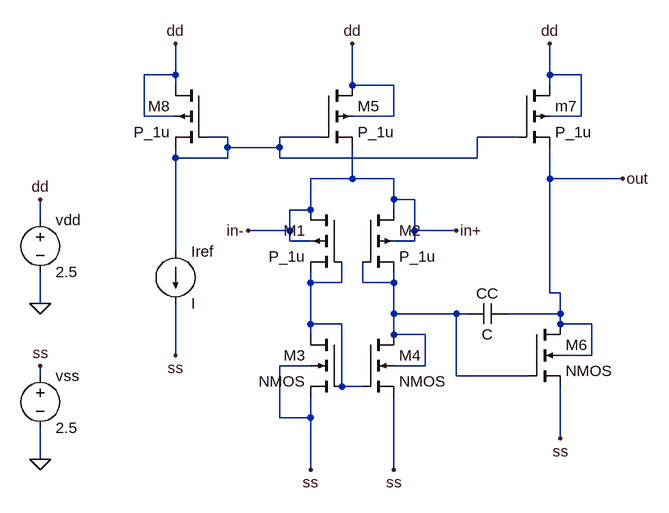
[diagram p0: schematic Draft1.asc]
Draft1.asc, the LTspice schematic file:
Version 4
SHEET 1 880 680
WIRE -272 -272 -272 -320
WIRE -272 -272 -320 -272
WIRE 304 -272 304 -320
WIRE 352 -272 304 -272
WIRE -272 -256 -272 -272
WIRE 0 -256 0 -320
WIRE 64 -256 0 -256
WIRE 304 -256 304 -272
WIRE -320 -208 -320 -272
WIRE -272 -208 -320 -208
WIRE 64 -208 64 -256
WIRE 64 -208 0 -208
WIRE 352 -208 352 -272
WIRE 352 -208 304 -208
WIRE -192 -176 -224 -176
WIRE -48 -176 -112 -176
WIRE 256 -176 192 -176
WIRE -192 -160 -192 -176
WIRE -112 -160 -112 -176
WIRE -112 -160 -192 -160
WIRE -272 -144 -272 -160
WIRE -192 -144 -192 -160
WIRE -192 -144 -272 -144
WIRE -112 -144 -112 -160
WIRE 192 -144 192 -176
WIRE 192 -144 -112 -144
WIRE 0 -112 0 -160
WIRE 0 -112 -64 -112
WIRE 64 -112 0 -112
WIRE 304 -112 304 -160
WIRE 416 -112 304 -112
WIRE 64 -80 64 -112
WIRE 96 -80 64 -80
WIRE -64 -64 -64 -112
WIRE -64 -64 -96 -64
WIRE 64 -64 64 -80
WIRE -480 -48 -480 -80
WIRE -96 -32 -96 -64
WIRE -96 -32 -160 -32
WIRE 96 -32 96 -80
WIRE 160 -32 96 -32
WIRE -96 -16 -96 -32
WIRE -64 -16 -96 -16
WIRE 96 -16 96 -32
WIRE 96 -16 64 -16
WIRE -272 0 -272 -144
WIRE -64 48 -64 32
WIRE -16 48 -16 16
WIRE -16 48 -64 48
WIRE 16 48 16 16
WIRE 64 48 64 32
WIRE 64 48 16 48
WIRE 304 64 304 -112
WIRE 320 64 304 64
WIRE -480 80 -480 32
WIRE 64 96 64 48
WIRE 160 96 64 96
WIRE 176 96 160 96
WIRE 320 96 320 64
WIRE 320 96 240 96
WIRE -64 112 -64 48
WIRE -16 112 -64 112
WIRE 320 112 320 96
WIRE 368 112 320 112
WIRE -64 128 -64 112
WIRE 64 128 64 96
WIRE 112 128 64 128
WIRE -272 160 -272 80
WIRE 368 160 368 112
WIRE 368 160 320 160
WIRE -64 176 -112 176
WIRE 112 176 112 128
WIRE 112 176 64 176
WIRE -480 192 -480 176
WIRE 160 192 160 96
WIRE 272 192 160 192
WIRE -16 208 -16 112
WIRE 16 208 -16 208
WIRE -112 256 -112 176
WIRE -64 256 -64 224
WIRE -64 256 -112 256
WIRE 320 288 320 208
WIRE -480 320 -480 272
WIRE -64 336 -64 256
WIRE 64 336 64 224
FLAG -480 80 0
FLAG -480 -80 dd
FLAG -272 -320 dd
FLAG 0 -320 dd
FLAG 304 -320 dd
FLAG -160 -32 in-
FLAG 160 -32 in+
FLAG 416 -112 out
FLAG -64 336 ss
FLAG 64 336 ss
FLAG 320 288 ss
FLAG -272 160 ss
FLAG -480 320 0
FLAG -480 176 ss
SYMBOL voltage -480 -64 R0
WINDOW 123 0 0 Left 2
WINDOW 39 0 0 Left 2
SYMATTR InstName vdd
SYMATTR Value 2.5
SYMBOL pmos4 -224 -256 M0
SYMATTR InstName M8
SYMATTR Value P_1u
SYMBOL pmos4 -48 -256 R0
SYMATTR InstName M5
SYMATTR Value P_1u
SYMBOL pmos4 256 -256 R0
SYMATTR InstName m7
SYMATTR Value P_1u
SYMBOL pmos4 -16 -64 M0
SYMATTR InstName M1
SYMATTR Value P_1u
SYMBOL pmos4 16 -64 R0
SYMATTR InstName M2
SYMATTR Value P_1u
SYMBOL nmos4 -16 128 M0
SYMATTR InstName M3
SYMBOL nmos4 16 128 R0
SYMATTR InstName M4
SYMBOL current -272 0 R0
SYMATTR InstName Iref
SYMBOL nmos4 272 112 R0
SYMATTR InstName M6
SYMBOL cap 240 80 R90
WINDOW 0 0 32 VBottom 2
WINDOW 3 32 32 VTop 2
SYMATTR InstName CC
SYMBOL voltage -480 176 R0
WINDOW 123 0 0 Left 2
WINDOW 39 0 0 Left 2
SYMATTR InstName vss
SYMATTR Value 2.5

The netlist it stands for:
* Draft1.asc
vdd dd 0 2.5
M8 dd N001 N001 dd P_1u
M5 dd N001 in+ dd P_1u
m7 dd N001 out dd P_1u
M1 in+ N002 N002 in+ P_1u
M2 in+ N003 N003 in+ P_1u
M3 N002 N002 ss ss NMOS
M4 N003 N002 ss N003 NMOS
Iref N001 ss I
M6 out N003 ss out NMOS
CC out N003 C
vss ss 0 2.5
.model NMOS NMOS
.model PMOS PMOS
.lib standard.mos
.backanno
.end